# EAGLE design Plipbox (EAGLE 6.6.0)
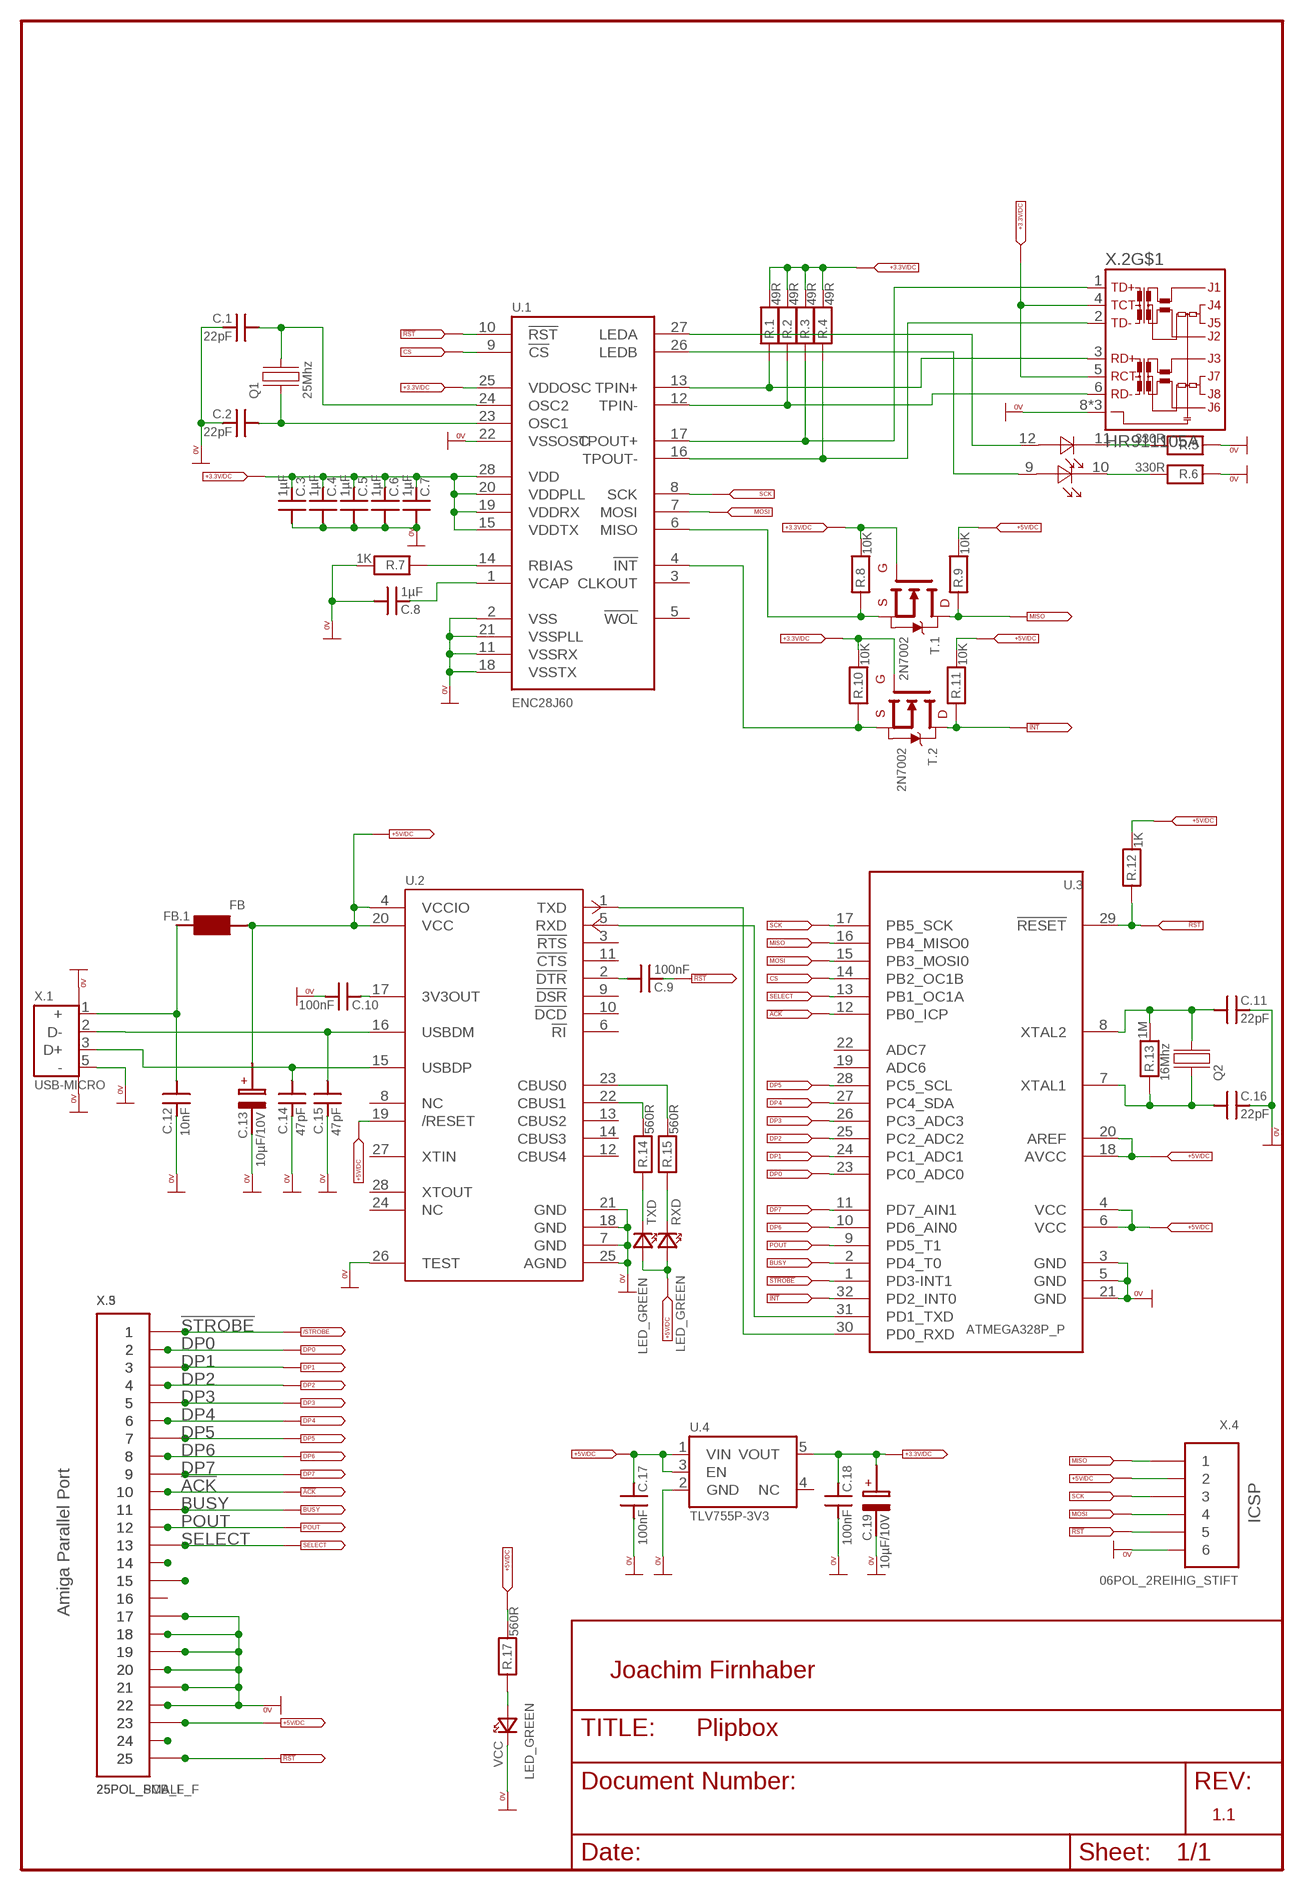
[diagram p0: schematic, sheet 1]

## Parts
C.1  22pF  CAPACITOR_SMD_0805  [0805]
C.2  22pF  CAPACITOR_SMD_0805  [0805]
C.3  1µF  CAPACITOR_SMD_0805  [0805]
C.4  1µF  CAPACITOR_SMD_0805  [0805]
C.5  1µF  CAPACITOR_SMD_0805  [0805]
C.6  1µF  CAPACITOR_SMD_0805  [0805]
C.7  1µF  CAPACITOR_SMD_0805  [0805]
C.8  1µF  CAPACITOR_SMD_0805  [0805]
C.9  100nF  CAPACITOR_SMD_0805  [0805]
C.10  100nF  CAPACITOR_SMD_0805  [0805]
C.11  22pF  CAPACITOR_SMD_0805  [0805]
C.12  10nF  CAPACITOR_SMD_0805  [0805]
C.13  10µF/10V  TANTAL_SMD_A(3216)  [3216]
C.14  47pF  CAPACITOR_SMD_0805  [0805]
C.15  47pF  CAPACITOR_SMD_0805  [0805]
C.16  22pF  CAPACITOR_SMD_0805  [0805]
C.17  100nF  CAPACITOR_SMD_0805  [0805]
C.18  100nF  CAPACITOR_SMD_0805  [0805]
C.19  10µF/10V  TANTAL_SMD_A(3216)  [3216]
FB.1  FB  FERRIT-BEAD  [0805]
Q1  25Mhz  QUARZ_3,4X2,7  [3,4X2,7X0,75]
Q2  16Mhz  QUARZ_3,4X2,7  [3,4X2,7X0,75]
R.1  49R  RESISTOR_SMD_0805  [0805]
R.2  49R  RESISTOR_SMD_0805  [0805]
R.3  49R  RESISTOR_SMD_0805  [0805]
R.4  49R  RESISTOR_SMD_0805  [0805]
R.5  330R  RESISTOR_SMD_0805  [0805]
R.6  330R  RESISTOR_SMD_0805  [0805]
R.7  1K  RESISTOR_SMD_0805  [0805]
R.8  10K  RESISTOR_SMD_0805  [0805]
R.9  10K  RESISTOR_SMD_0805  [0805]
R.10  10K  RESISTOR_SMD_0805  [0805]
R.11  10K  RESISTOR_SMD_0805  [0805]
R.12  1K  RESISTOR_SMD_0805  [0805]
R.13  1M  RESISTOR_SMD_0805  [0805]
R.14  560R  RESISTOR_SMD_0805  [0805]
R.15  560R  RESISTOR_SMD_0805  [0805]
R.17  560R  RESISTOR_SMD_0805  [0805]
RXD  LED_GREEN  LED_0805  [0805]
T.1  2N7002  2N7002_N  [SOT23]
T.2  2N7002  2N7002_N  [SOT23]
TXD  LED_GREEN  LED_0805  [0805]
U.1  ENC28J60  EN28J60  [SSOP28]
U.2  FT232R_FT232RL  [SSOP28]
U.3  ATMEGA328P_P  [LQFP32]
U.4  TLV755P-3V3  TLV755P  [SOT23-5]
VCC  LED_GREEN  LED_0805  [0805]
X.1  USB-MICRO  [USB_MICRO]
X.2  HR911105A  [HR911105A]
X.3  25POL_PCB_F  [SUB-D_25F_L]
X.4  06POL_2REIHIG_STIFT  [STIFT_2*03]
X.5  25POL_SMALL_F  [SUB-D_25F_ONLY]

## Nets
0V: C.1.2 C.2.2 C.3.1 C.4.1 C.5.1 C.6.1 C.7.1 C.8.1 C.10.1 C.11.2 C.12.2 C.13.- C.14.2 C.15.2 C.16.2 C.17.1 C.18.1 C.19.- R.5.1 R.6.1 R.7.2 U.1.2(VSS) U.1.11(VSSRX) U.1.18(VSSTX) U.1.21(VSSPLL) U.1.22(VSSOSC) U.2.7(GND) U.2.18(GND) U.2.21(GND) U.2.25(AGND) U.2.26(TEST) U.3.3(GND) U.3.5(GND) U.3.21(GND) U.4.2(GND) VCC.K(KATHODE) X.1.5(-) X.1.6(GND) X.1.7(GND) X.2.8(GND) X.2.Z1(GND) X.2.Z2(GND) X.3.17 X.3.18 X.3.19 X.3.20 X.3.21 X.3.22 X.4.6 X.5.17 X.5.18 X.5.19 X.5.20 X.5.21 X.5.22
!ACK: U.3.12(PB0_ICP) X.3.10 X.5.10
!INT: R.11.1 T.2.3(DRAIN) U.3.32(PD2_INT0)
!RST: C.9.2 R.12.1 U.1.10(!RST) U.3.29(!RESET) X.3.25 X.4.5 X.5.25
!STROBE: U.3.1(PD3-INT1) X.3.1 X.5.1 ; supply symbol labelled /STROBE
+3.3V: C.3.2 C.4.2 C.5.2 C.6.2 C.7.2 C.18.2 C.19.+ R.1.2 R.2.2 R.3.2 R.4.2 R.8.2 R.10.2 T.1.1(GATE) T.2.1(GATE) U.1.15(VDDTX) U.1.19(VDDRX) U.1.20(VDDPLL) U.1.25(VDDOSC) U.1.28(VDD) U.4.5(VOUT) X.2.4(TCT-) X.2.5(RCT-) ; supply symbol labelled +3.3V-OUT, +3.3V-IN
+5V: C.13.+ C.17.2 FB.1.1 R.9.2 R.11.2 R.12.2 R.17.2 RXD.A(ANODE) TXD.A(ANODE) U.2.4(VCCIO) U.2.19(/RESET) U.2.20(VCC) U.3.4(VCC) U.3.6(VCC) U.3.18(AVCC) U.3.20(AREF) U.4.1(VIN) U.4.3(EN) X.3.23 X.4.2 X.5.23 ; supply symbol labelled +5V-IN, +5V-OUT
/RXLED: R.14.2 U.2.22(CBUS1)
/TXLED: R.15.2 U.2.23(CBUS0)
BUSY: U.3.2(PD4_T0) X.3.11 X.5.11
CS: U.1.9(!CS) U.3.14(PB2_OC1B)
DP0: U.3.23(PC0_ADC0) X.3.2 X.5.2
DP1: U.3.24(PC1_ADC1) X.3.3 X.5.3
DP2: U.3.25(PC2_ADC2) X.3.4 X.5.4
DP3: U.3.26(PC3_ADC3) X.3.5 X.5.5
DP4: U.3.27(PC4_SDA) X.3.6 X.5.6
DP5: U.3.28(PC5_SCL) X.3.7 X.5.7
DP6: U.3.10(PD6_AIN0) X.3.8 X.5.8
DP7: U.3.11(PD7_AIN1) X.3.9 X.5.9
MISO: R.9.1 T.1.3(DRAIN) U.3.16(PB4_MISO0) X.4.1
MOSI: U.1.7(MOSI) U.3.15(PB3_MOSI0) X.4.4
N$1: C.16.1 Q2.2(XTAL1) R.13.1 U.3.7(XTAL1)
N$2: R.4.1 U.1.16(TPOUT-) X.2.2(TD-)
N$3: C.9.1 U.2.2(!DTR)
N$4: R.1.1 U.1.13(TPIN+) X.2.3(RD+)
N$5: C.11.1 Q2.4(XTAL2) R.13.2 U.3.8(XTAL2)
N$6: R.2.1 U.1.12(TPIN-) X.2.6(RD-)
N$7: R.3.1 U.1.17(TPOUT+) X.2.1(TD+)
N$8: C.8.2 U.1.1(VCAP)
N$9: R.7.1 U.1.14(RBIAS)
N$10: R.8.1 T.1.2(SOURCE) U.1.6(MISO)
N$11: X.3.14 X.5.14
N$12: C.2.1 Q1.2(XTAL1) U.1.23(OSC1)
N$13: C.1.1 Q1.4(XTAL2) U.1.24(OSC2)
N$14: R.10.1 T.2.2(SOURCE) U.1.4(!INT)
N$15: X.3.15 X.5.15
N$16: X.3.16 X.5.16
N$18: X.3.24 X.5.24
N$24: U.1.27(LEDA) X.2.12(A)
N$25: U.1.26(LEDB) X.2.9(A)
N$26: R.6.2 X.2.10(K)
N$27: R.5.2 X.2.11(K)
N$28: C.10.2 U.2.17(3V3OUT)
N$29: R.15.1 RXD.K(KATHODE)
N$30: R.14.1 TXD.K(KATHODE)
N$31: U.2.1(TXD) U.3.30(PD0_RXD)
N$32: R.17.1 VCC.A(ANODE)
N$103: C.12.1 FB.1.2 X.1.1(+)
POUT: U.3.9(PD5_T1) X.3.12 X.5.12
SCK: U.1.8(SCK) U.3.17(PB5_SCK) X.4.3
SELECT: U.3.13(PB1_OC1A) X.3.13 X.5.13
TXD1: U.2.5(RXD) U.3.31(PD1_TXD)
USB+: C.14.1 U.2.15(USBDP) X.1.3(D+)
USB-: C.15.1 U.2.16(USBDM) X.1.2(D-)
Unconnected: U.1.3(CLKOUT) U.1.5(!WOL) U.2.3(!RTS) U.2.6(!RI) U.2.8(NC) U.2.9(!DSR) U.2.10(!DCD) U.2.11(!CTS) U.2.12(CBUS4) U.2.13(CBUS2) U.2.14(CBUS3) U.2.24(NC) U.2.27(XTIN) U.2.28(XTOUT) U.3.19(ADC6) U.3.22(ADC7) U.4.4(NC)

## Notes on the sheet
- ICSP
- Amiga Parallel Port
- Joachim Firnhaber
- 1.1

## Library data of the parts
C.1-C.12 C.14-C.18 = de_discrete:CAPACITOR
C.13 C.19 = de_discrete:TANTAL*
FB.1 = de_discrete:FERRIT-BEAD
Q1 Q2 = de_crystal:QUARZ
R.1-R.15 R.17 = de_discrete:RESISTOR
RXD TXD VCC = de_light:LED
T.1 T.2 = de_transistor:2N7002
U.1 = de_ic:EN28J60
U.2 = de_ic:FT232R
U.3 = de_controller:ATMEGA328P
U.4 = de_power:TLV755P
X.1 = de_connectors:USB-MICRO; FCI: 10104110-0001LF
X.2 = de_lan:HR911105A
X.3 X.5 = de_connectors:25POL
X.4 = de_connectors:06POL

## Board
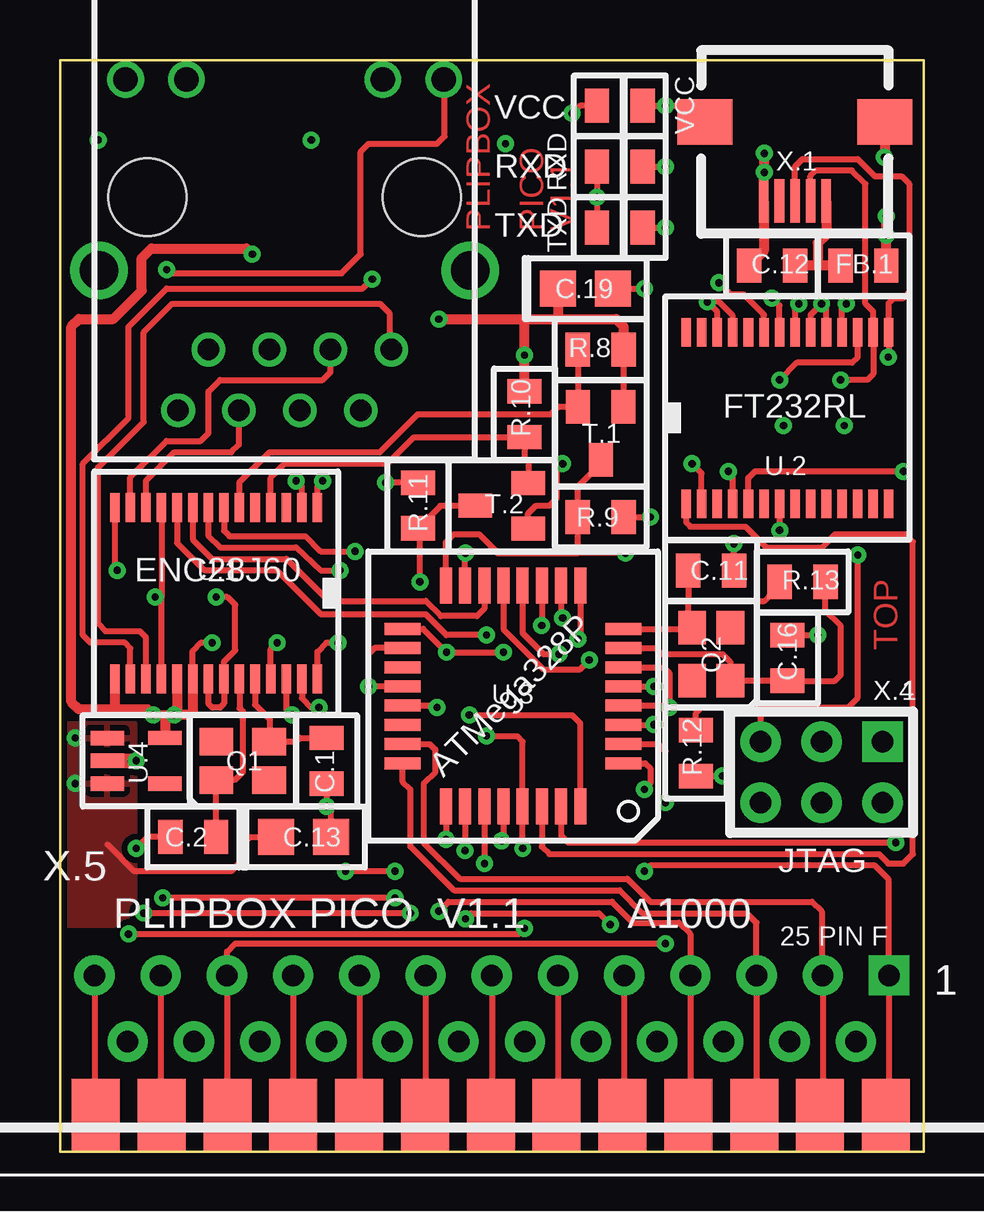
[diagram p1: board, top side]
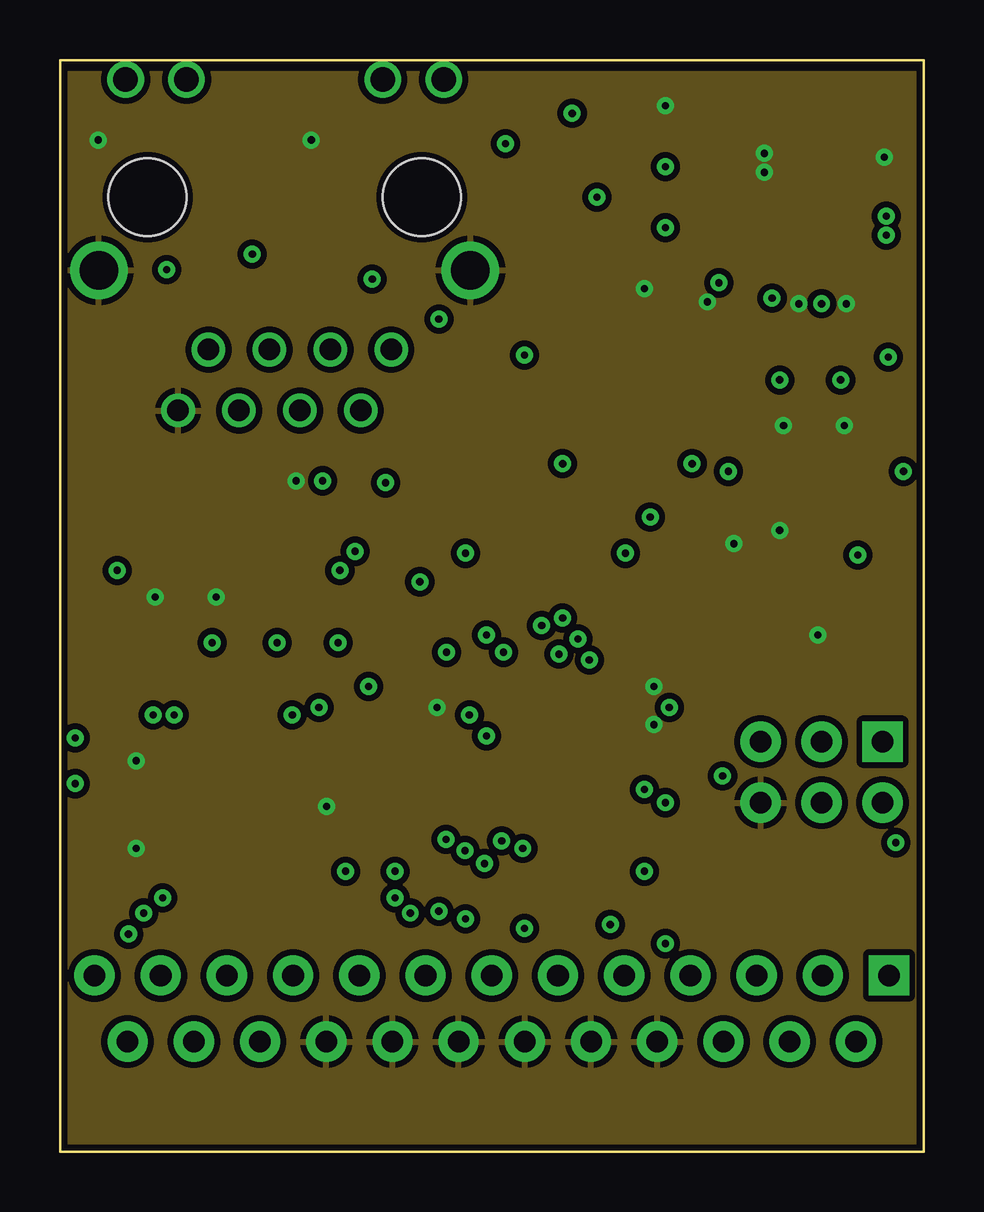
[diagram p2: board, inner layer 0V]
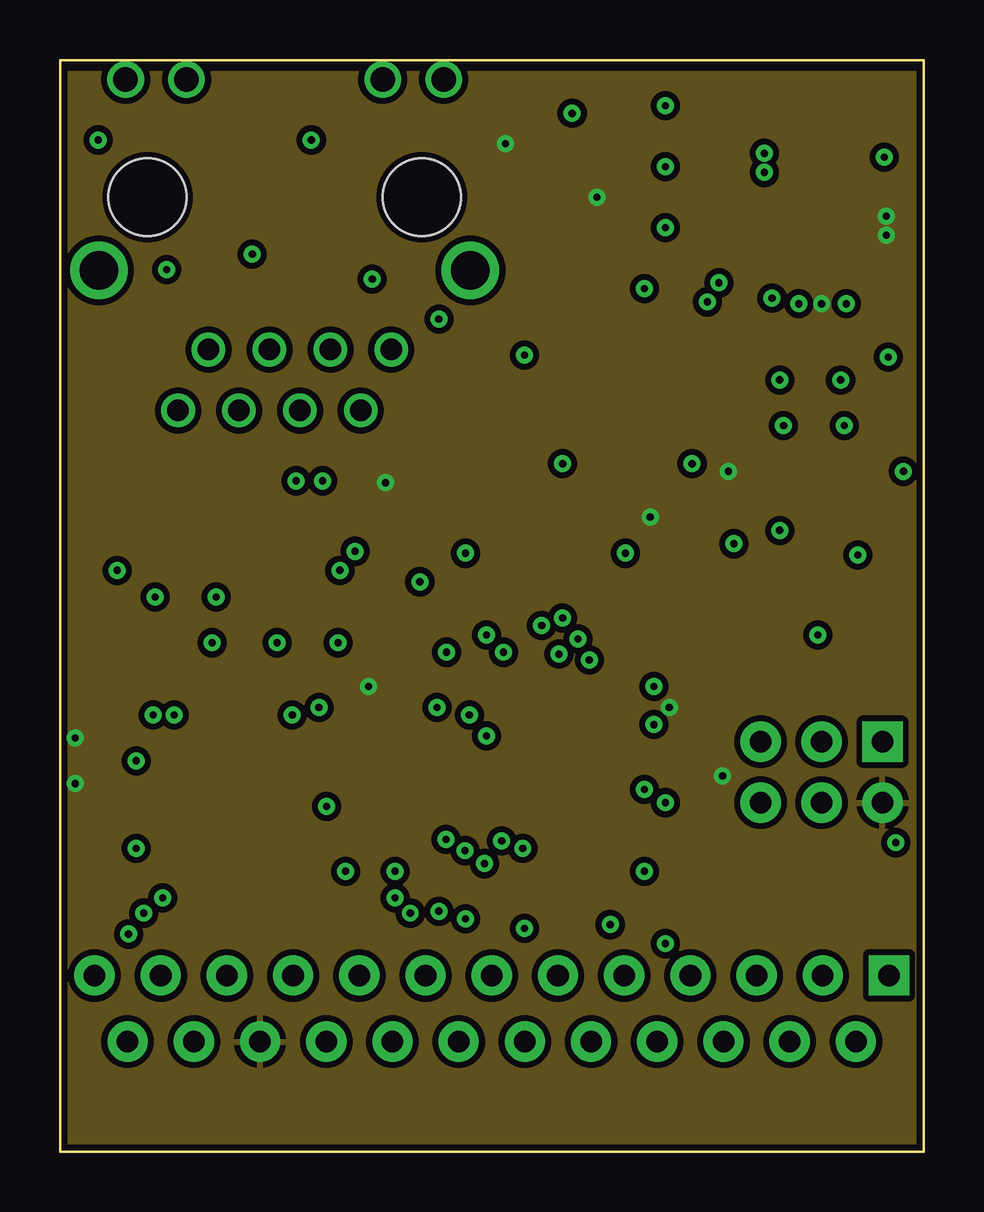
[diagram p3: board, inner layer +5V]
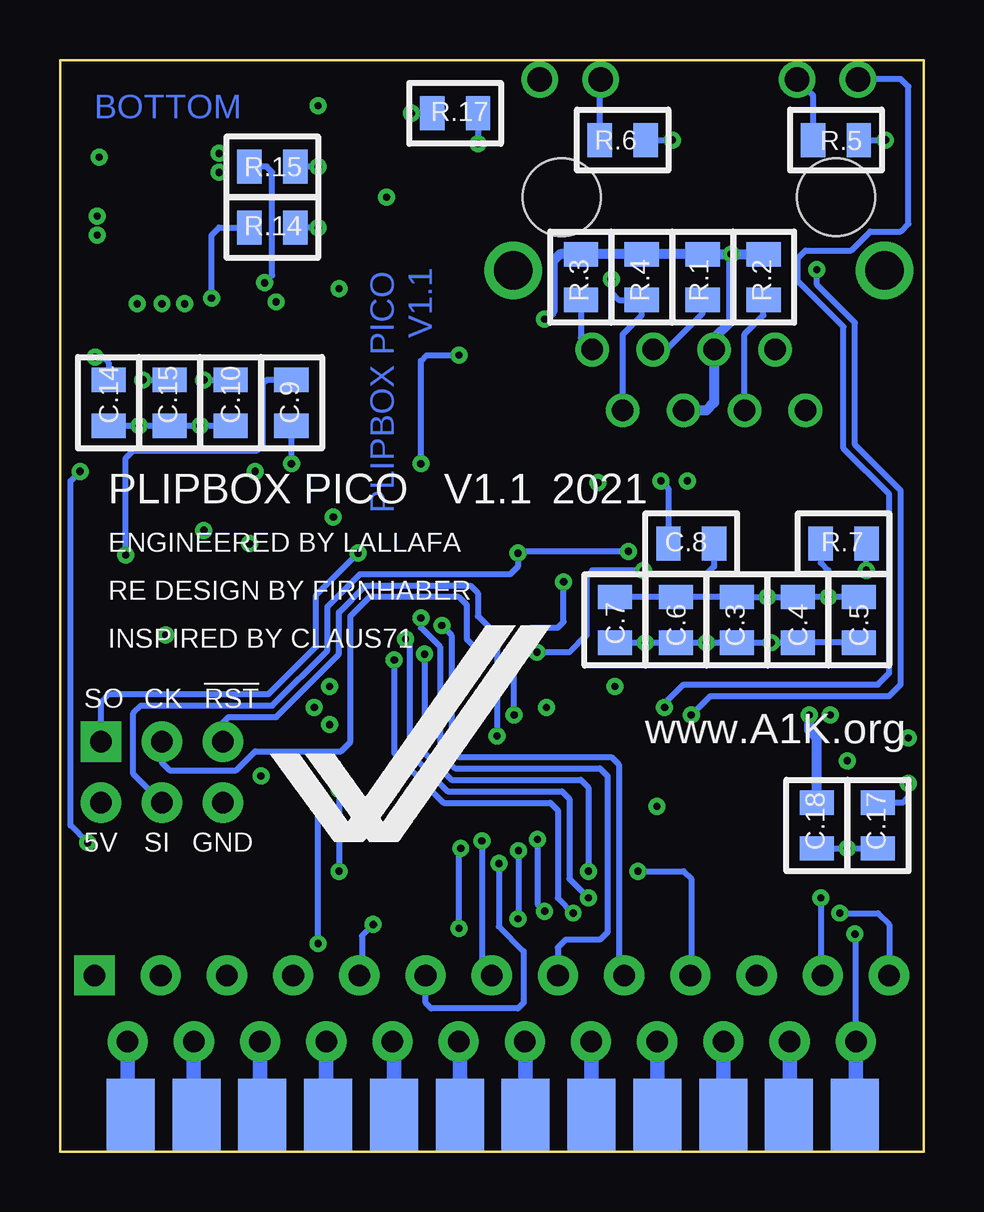
[diagram p4: board, bottom side, seen from below]

Size 36 x 45.5 mm. Coordinates in mm from the lower left corner, seen from the top.
Outline: 0,0 36,0 36,45.5 0,45.5 0,0
Copper layers (1*2*3*16): Top 0.035mm / dielectric 1.5mm / 0V 0.035mm / dielectric 0.15mm / +5V 0.035mm / dielectric 0.2mm / Bottom 0.035mm
Design rules "default *": minimum track width 10mil, minimum drill 10mil, track to track 5mil, track to pad 5mil, pad to pad 5mil, via to via 5mil, smd to smd 1mil, copper to edge 10mil, drill to drill 8mil, minimum pad ring 10mil, minimum via ring 8mil, stop-mask expansion 4mil, vias tented up to drill 20mil, thermal gap 10mil

### Footprints (pad centres in the part's own frame; a part is rotated, then mirrored left to right if it is on the bottom)
0805 = smd 1.016 x 1.422: 1 -0.953,0; 2 0.953,0
3216 = smd 1.5 x 1.5: + -1.15,0; - 1.15,0
3,4X2,7X0,75 = smd 1.4 x 1.15: 1 -1.1,0.8; 2 -1.1,-0.8; 3 1.1,-0.8; 4 1.1,0.8
0805' = smd 1.016 x 1.422: A -0.953,0; K 0.953,0
SOT23 = smd 1 x 1.4: 1 -0.95,-1.1; 2 0.95,-1.1; 3 0,1.1
SSOP28 = smd 0.4 x 1.2: 1 -4.225,-3.575; 2 -3.575,-3.575; 3 -2.925,-3.575; 4 -2.275,-3.575; 5 -1.625,-3.575; 6 -0.975,-3.575; 7 -0.325,-3.575; 8 0.325,-3.575; 9 0.975,-3.575; 10 1.625,-3.575; 11 2.275,-3.575; 12 2.925,-3.575; 13 3.575,-3.575; 14 4.225,-3.575; 15 4.225,3.575; 16 3.575,3.575; 17 2.925,3.575; 18 2.275,3.575; 19 1.625,3.575; 20 0.975,3.575; 21 0.325,3.575; 22 -0.325,3.575; 23 -0.975,3.575; 24 -1.625,3.575; 25 -2.275,3.575; 26 -2.925,3.575; 27 -3.575,3.575; 28 -4.225,3.575
LQFP32 = smd 1.5 x 0.5: 1 -4.6,2.8; 2 -4.6,2; 3 -4.6,1.2; 4 -4.6,0.4; 5 -4.6,-0.4; 6 -4.6,-1.2; 7 -4.6,-2; 8 -4.6,-2.8; 17 4.6,-2.8; 18 4.6,-2; 19 4.6,-1.2; 20 4.6,-0.4; 21 4.6,0.4; 22 4.6,1.2; 23 4.6,2; 24 4.6,2.8 | smd 0.5 x 1.5: 9 -2.8,-4.6; 10 -2,-4.6; 11 -1.2,-4.6; 12 -0.4,-4.6; 13 0.4,-4.6; 14 1.2,-4.6; 15 2,-4.6; 16 2.8,-4.6; 25 2.8,4.6; 26 2,4.6; 27 1.2,4.6; 28 0.4,4.6; 29 -0.4,4.6; 30 -1.2,4.6; 31 -2,4.6; 32 -2.8,4.6
SOT23-5 = smd 0.6 x 1.4: 1 -0.95,-1.2; 2 -0.003,-1.2; 3 0.95,-1.2; 4 0.953,1.2; 5 -0.953,1.2
USB_MICRO = smd 0.4 x 1.8: 1 -1.3,-0.318; 2 -0.65,-0.318; 3 0,-0.318; 4 0.65,-0.318; 5 1.3,-0.318 | smd 2.3 x 1.9: 6 -3.75,-3.615; 7 3.75,-3.615
HR911105A = drill 0.9: 1 4.445,-6.35; 2 3.175,-8.89; 3 1.905,-6.35; 4 0.635,-8.89; 5 -0.635,-6.35; 6 -1.905,-8.89; 7 -3.175,-6.35; 8 -4.445,-8.89 | drill 1.02: 9 6.63,4.91; 10 4.09,4.91; 11 -4.09,4.91; 12 -6.63,4.91 | drill 1.6: Z1 -7.745,-3.05; Z2 7.745,-3.05 | hole 3.25: 5.715,0; -5.715,0
SUB-D_25F_L = smd 2 x 3: 1 16.466,0.5; 2 13.721,0.5; 3 10.976,0.5; 4 8.231,0.5; 5 5.486,0.5; 6 2.741,0.5; 7 -0.004,0.5; 8 -2.749,0.5; 9 -5.494,0.5; 10 -8.237,0.5; 11 -10.98,0.5; 12 -13.723,0.5; 13 -16.466,0.5 | smd 2 x 3 bottom: 14 15.095,0.5; 15 12.35,0.5; 16 9.605,0.5; 17 6.86,0.5; 18 4.115,0.5; 19 1.37,0.5; 20 -1.375,0.5; 21 -4.12,0.5; 22 -6.865,0.5; 23 -9.608,0.5; 24 -12.352,0.5; 25 -15.095,0.5
STIFT_2*03 = drill 0.9 pad 1.676 square: 1 -1.27,2.54 | drill 0.9 pad 1.676: 2 1.27,2.54; 3 -1.27,0; 4 1.27,0; 5 -1.27,-2.54; 6 1.27,-2.54
SUB-D_25F_ONLY = drill 0.9 pad 1.676 square: 1 16.56,13.84 | drill 0.9 pad 1.676: 2 13.8,13.84; 3 11.04,13.84; 4 8.28,13.84; 5 5.52,13.84; 6 2.76,13.84; 7 0,13.84; 8 -2.76,13.84; 9 -5.52,13.84; 10 -8.28,13.84; 11 -11.04,13.84; 12 -13.8,13.84; 13 -16.56,13.84; 14 15.18,11.08; 15 12.42,11.08; 16 9.66,11.08; 17 6.9,11.08; 18 4.14,11.08; 19 1.38,11.08; 20 -1.38,11.08; 21 -4.14,11.08; 22 -6.9,11.08; 23 -9.66,11.08; 24 -12.42,11.08; 25 -15.18,11.08

### Placement (x,y rotation side)
C.1  11.11,16.29 270 top
C.2  5.56,13.11 180 top
C.3  7.78,22.16 270 bottom
C.4  5.24,22.16 270 bottom
C.5  2.7,22.16 270 bottom
C.6  10.32,22.16 270 bottom
C.7  12.86,22.16 270 bottom
C.8  9.68,25.34 180 bottom
C.9  26.35,31.21 90 bottom
C.10  28.89,31.21 90 bottom
C.11  27.15,24.23 0 top
C.12  29.69,36.92 180 top
C.13  10.16,13.11 0 top
C.14  33.97,31.21 270 bottom
C.15  31.43,31.21 270 bottom
C.16  30.32,20.57 90 top
C.17  1.91,13.59 90 bottom
C.18  4.45,13.59 90 bottom
C.19  21.91,35.97 0 top
FB.1  33.5,36.92 180 top
Q1  7.62,16.29 0 top
Q2  27.15,20.73 90 top
R.1  9.21,36.45 90 bottom
R.2  6.67,36.45 90 bottom
R.3  14.29,36.45 90 bottom
R.4  11.75,36.45 90 bottom
R.5  3.65,42.16 180 bottom
R.6  12.54,42.16 180 bottom
R.7  3.33,25.34 180 bottom
R.8  22.54,33.43 0 top
R.9  22.54,26.45 0 top
R.10  19.37,30.73 90 top
R.11  14.92,26.92 90 top
R.12  26.51,16.61 270 top
R.13  30.96,23.75 180 top
R.14  27.15,38.51 180 bottom
R.15  27.15,41.05 180 bottom
R.17  19.53,43.27 0 bottom
RXD  LED_GREEN  [0805']  23.34,41.05 0 top
T.1  22.54,29.94 180 top
T.2  18.41,26.92 90 top
TXD  LED_GREEN  [0805']  23.34,38.51 0 top
U.1  6.51,23.27 180 top
U.2  30.32,30.57 0 top
U.3  18.89,18.99 180 top
U.4  3.17,16.29 270 top
VCC  LED_GREEN  [0805']  23.34,43.59 0 top
X.1  30.64,39.31 180 top
X.2  9.37,39.78 0 top
X.3  17.96,1.04 0 top
X.4  31.75,15.81 270 top
X.5  18,-6.5 0 top

### Tracks (layer width: path | path; a pad name or v marks a point on that pad's centre or on a via)
0V  (via drill 0.3)
  Top 0.254: C.13.- 11.31,14.19 v11.11,14.38 C.1.2 | C.2.2 3.65,13.11 v3.17,12.64 | v3.17,16.29 | U.1.18 4.23,23.06 | 4.23,23.06 4.23,23.09 | 4.23,23.09 v3.97,23.11 4.23,23.06 | v6.51,23.11 6.99,23.11 7.3,22.8 7.3,20.89 6.83,20.42 U.1.22 6.83,18.68 6.67,18.51 6.35,18.51 6.18,18.68 U.1.21 | U.1.11 4.23,23.09 | U.3.21 15.64,18.59 v15.72,18.51 | C.11.2 v28.1,25.34 | U.2.7 30,26.04 v30,25.89 | C.16.2 v31.59,21.53 | U.1.2 10.08,27.72 v9.84,27.96 | VCC.K v25.24,43.59 26.85,43.59 X.1.7 | U.2.18 32.6,35.15 v32.78,35.34 | U.2.21 30.65,35.19 v30.8,35.34 | C.19.- v24.37,35.97 | U.3.3 24.84,17.79 v24.77,17.8 | U.3.5 24.84,19.39 v24.77,19.38 | U.2.25 28.05,34.83 27.46,35.42 v26.99,35.42 27.4,35.01 U.2.26
  Top 0.406: C.12.2 29.34,37.53 X.1.5 29.34,40.78 v29.37,40.81 v29.37,41.61 | X.1.6 34.39,41.47 v34.37,41.45
  Top 0.61: U.4.2 v3.17,16.29
  Bottom 0.254: C.17.1 v3.17,12.64 C.18.1 | v3.97,23.11 C.4.1 v6.51,23.11 C.3.1 9.05,23.11 | C.5.1 v3.97,23.11 | R.7.2 4.29,24.54 3.97,24.23 v3.97,23.11 | 9.05,23.11 C.6.1 C.7.1 | C.8.1 8.73,24.38 9.05,24.07 9.05,23.11 | R.6.1 v10.48,42.16 | C.14.2 v32.7,30.26 C.15.2 v30.16,30.26 C.10.1 | R.5.1 v1.59,42.16 | 24.9,1.61 X.3.17
  Bottom 0.61: X.5.17 24.9,1.61 | X.3.22 X.5.22 | X.3.21 13.84,4.56 X.5.21 | X.3.20 16.59,4.55 X.5.20 | X.3.19 19.33,4.53 X.5.19 | X.3.18 22.08,4.52 X.5.18
  pour 0V (isolate 0.254): 0,0 0,45 36,45 36,0
!ACK  (via drill 0.3)
  Top 0.254: U.3.12 19.29,22.4 19.29,21.61 20.16,20.73 v20.8,20.73 | X.5.10 X.3.10 | v13.97,11.68 v11.91,11.68
  Bottom 0.254: v20.8,20.73 20.8,16.61 19.68,15.49 14.29,15.49 13.97,15.18 v13.97,11.68 | v11.91,11.68 10,11.68 9.68,11.37 9.68,7.38 X.5.10
!INT  (via drill 0.3)
  Top 0.254: T.2.3 15.86,26.91 R.11.1 15,25.89 v15,23.75 | v17.07,18.19 21.35,18.19 21.69,17.85 U.3.32
  Bottom 0.254: v17.07,18.19 17.07,21.13 16.35,21.84 15.24,21.84 15,22.08 v15,23.75
!RST  (via drill 0.3)
  Top 0.254: U.1.10 4.88,25.37 6.03,24.23 9.05,24.23 10.87,22.4 15.24,22.4 16.11,21.53 v17.78,21.53 | 29.21,18.51 32.86,18.51 33.26,18.91 v33.26,24.86 | R.12.1 26.51,18.27 26.75,18.51 29.21,18.51 | X.4.5 29.21,18.51 | v2.86,9.06 19.13,9.06 v19.37,9.3 | v19.29,12.64 U.3.29 19.29,17.08 19.05,17.32 v17.78,17.32
  Bottom 0.254: C.9.2 27.38,32.16 27.54,32 27.54,29.46 27.78,29.23 32.94,29.23 33.26,28.91 v33.26,24.86 | X.4.5 29.21,17.88 28.97,18.11 26.99,18.11 24.37,20.73 24.37,22.48 23.26,23.59 18.89,23.59 18.57,23.27 18.57,22.32 v17.78,21.53 v17.78,17.32 | 2.82,1.58 X.3.25 | X.5.25 2.82,8.95 v2.86,9.06 | v19.37,9.3 19.37,12.56 v19.29,12.64
  Bottom 0.61: X.5.25 2.82,1.58
!STROBE  (via drill 0.3)
  Top 0.254: U.3.1 24.39,16.19 24.61,15.97 24.61,15.34 v24.37,15.1 | X.3.1 34.56,1.67 X.5.1 34.53,7.37 34.53,11.37 33.97,11.92 24.61,11.92 v24.37,11.68
  Bottom 0.254: v24.37,15.1 v24.37,11.68
+3.3V  (via drill 0.3)
  Top 0.254: 4.88,18.31 v4.76,18.19 | U.1.20 5.53,20.87 5.87,21.21 v6.35,21.21 | U.1.25 8.78,20.94 v9.05,21.21 | U.1.28 10.73,20.83 11.11,21.21 v11.59,21.21 | R.8.2 T.1.1 | 2.27,18.43 2.28,18.45 | T.2.1 19.52,26.59 19.84,26.92 20.4,26.92 20.72,27.24 20.72,28.43 v20.95,28.67
  Top 0.406: U.1.19 4.88,18.31 | U.1.20 5.53,18.33 5.4,18.19 v4.76,18.19 v3.89,18.19 | U.1.15 2.28,18.45 | v15.8,34.7 19.37,34.7 | 19.37,34.7 20.8,34.7 | v3.89,18.19 4.38,18.19 U.4.5 | v3.89,18.19 3.65,18.43 2.27,18.43 0.79,18.43 0.48,18.75 0.48,34.38 0.79,34.7 2.22,34.7 3.41,35.89 3.41,37.24 3.81,37.64 7.78,37.64 v8.02,37.4 | C.19.+ 20.76,34.74 20.8,34.7 | 20.8,34.7 23.18,34.7 23.5,34.38 R.8.2 | R.10.2 v19.37,33.19 19.37,34.7
  Bottom 0.254: C.7.2 v11.59,21.21 C.6.2 v9.05,21.21 C.3.2 v6.35,21.21 C.4.2 C.5.2 | v20.95,28.67 20.95,32.96 20.72,33.19 v19.37,33.19
  Bottom 0.406: C.18.2 4.45,17.24 4.76,17.56 v4.76,18.19 | v8.02,37.4 R.1.2 R.4.2 R.3.2 15.16,37.4 15.48,37.08 15.48,35.02 v15.8,34.7 | v8.02,37.4 R.2.2 | X.2.4 9.05,30.89 8.73,31.21 X.2.5 8.73,33.91 8.02,34.62 v8.02,37.4
+5V  (via drill 0.3)
  Top 0.254: C.13.+ 7.94,13.11 7.62,12.79 7.62,12.16 7.14,11.68 3.1,11.68 1.98,12.79 | U.3.18 13.11,20.99 12.86,20.73 v12.86,19.38 v12.86,19.39 U.3.20 | RXD.A v22.38,39.78 TXD.A | U.2.19 31.95,35.14 v31.75,35.34 31.3,34.88 U.2.20 | R.11.2 v13.57,27.88 | R.9.2 v24.61,26.45 | U.2.4 28.05,28.17 v27.86,28.35 | U.3.6 25.15,20.19 25.4,19.94 25.4,18.59 | U.3.4 25.4,18.59 | v25.4,18.51 25.4,18.59 | R.12.2 v27.62,15.65
  Top 0.406: v34.45,38.99 FB.1.1 v34.45,38.2
  Bottom 0.254: v0.64,15.34 0.64,14.78 0.87,14.54 C.17.2 | R.17.2 v18.57,42.01 | 8.34,1.55 X.3.23
  Bottom 0.61: X.5.23 8.34,1.55
  other vias: 0.64,17.24
  pour +5V (isolate 0.254): 0,0 0,45 36,45 36,0
  pour Top (isolate 0.254): 0.24,9.38 3.17,9.38 3.17,17.88 0.24,17.88
/RXLED  (via drill 0.3)
  Top 0.254: U.2.22 30,35.27 v29.69,35.58
  Bottom 0.254: v29.69,35.58 29.69,38.2 29.37,38.51 R.14.2
/TXLED  (via drill 0.3)
  Top 0.254: U.2.23 29.35,34.88 28.5,35.73 27.94,35.73 v27.46,36.21
  Bottom 0.254: v27.46,36.21 27.15,36.53 27.15,40.81 27.38,41.05 R.15.2
BUSY  (via drill 0.3)
  Top 0.254: U.3.2 24.94,16.99 25.24,16.68 v25.24,14.54 | X.3.11 6.96,1.56 X.5.11 6.96,8.32 7.3,8.67 v25.24,8.67
  Bottom 0.254: v25.24,8.67 v25.24,14.54
CS
  Top 0.254: U.1.9 5.53,25.52 6.35,24.7 9.45,24.7 11.19,22.95 15.24,22.95 15.88,22.32 17.38,22.32 17.69,22.63 U.3.14
DP0
  Top 0.254: X.3.2 31.8,1.65 X.5.2 31.75,7.39 31.75,10.02 31.35,10.41 24.61,10.41 23.65,11.37 16.67,11.37 15.16,12.87 15.16,15.34 15.64,15.81 15.64,16.76 15.41,16.99 U.3.23
DP1
  Top 0.254: X.3.3 29.04,1.64 X.5.3 29.04,9.54 28.64,9.94 24.29,9.94 23.34,10.89 16.43,10.89 14.61,12.72 14.61,15.1 14.29,15.41 U.3.24
DP2  (via drill 0.3)
  Top 0.254: U.3.25 v16.09,13.01 | X.3.4 26.28,1.62 X.5.4 26.27,9.06 25.8,9.54 23.89,9.54 23.02,10.41 16.19,10.41 v15.8,10.02
  Bottom 0.254: v16.09,13.01 16.09,10.31 v15.8,10.02
DP3  (via drill 0.3)
  Top 0.254: U.3.26 v16.89,12.54 | X.5.5 23.52,1.61 X.3.5 | v16.91,9.7 17.14,9.94 22.46,9.94 v22.94,9.46
  Bottom 0.254: v16.89,12.54 16.89,9.95 v16.91,9.7 | v22.94,9.46 23.42,8.98 23.42,7.44 X.5.5
DP4  (via drill 0.3)
  Top 0.254: U.3.27 17.69,12.09 v17.7,12 | X.5.6 20.76,1.59 X.3.6
  Bottom 0.254: v17.7,12 17.7,9.38 16.67,8.35 16.67,6.21 16.91,5.97 20.52,5.97 20.76,6.21 X.5.6
DP5  (via drill 0.3)
  Top 0.254: 18.49,7.83 X.5.7 18,1.58 X.3.7 | U.3.28 18.49,13.03 v18.41,12.95
  Bottom 0.254: v18.41,12.95 18.41,7.75 X.5.7
DP6  (via drill 0.3 pad 0.15)
  Top 0.254: U.3.10 20.89,22.3 v20.95,22.24 | X.5.8 15.24,1.56 X.3.8
  Bottom 0.254: v20.95,22.24 20.95,21.84 20.16,21.05 20.16,16.61 19.53,15.97 13.49,15.97 13.18,15.65 13.18,9.14 13.49,8.83 14.92,8.83 15.24,8.51 X.5.8
DP7  (via drill 0.3 pad 0.15)
  Top 0.254: U.3.11 20.09,21.93 v20.08,21.92 | X.5.9 X.3.9
  Bottom 0.254: v20.08,21.92 19.68,21.53 19.68,16.76 19.37,16.45 13.02,16.45 12.7,16.13 12.7,7.56 X.5.9
MISO  (via drill 0.3)
  Top 0.254: T.1.3 22.54,28.67 21.59,27.72 R.9.1 21.59,24.94 | U.3.16 16.09,25.39 16.43,25.73 17.46,25.73 18.26,24.94 21.59,24.94 | v23.57,24.94 21.59,24.94
  Bottom 0.254: X.4.1 34.29,18.75 33.97,19.07 27.3,19.07 25.32,21.05 25.32,23.19 v23.57,24.94
MOSI  (via drill 0.3)
  Top 0.254: U.1.7 6.83,25.88 7.06,25.65 10.24,25.65 10.87,25.02 v12.3,25.02 | U.3.15 16.89,24.92 v16.91,24.94
  Bottom 0.254: X.4.4 32.94,15.73 32.94,18.27 32.62,18.59 27.15,18.59 24.84,20.89 24.84,22.72 23.5,24.07 17.22,24.07 16.91,24.38 v16.91,24.94 16.83,25.02 v12.3,25.02
N$1
  Top 0.254: R.13.1 31.91,22.56 32.54,21.92 32.54,19.86 32.31,19.62 C.16.1 Q2.2 27.94,20.41 27.62,20.73 25.08,20.73 24.83,20.99 U.3.7
N$2  (via drill 0.3)
  Top 0.254: U.1.16 2.93,20.97 2.7,21.21 1.27,21.21 0.95,21.53 0.95,28.67 2.86,30.57 2.86,34.38 4.45,35.97 12.62,35.97 v13.02,36.37
  Bottom 0.254: X.2.2 12.54,34.07 11.75,34.86 R.4.1 12.7,35.5 13.02,35.81 v13.02,36.37
N$3  (via drill 0.3)
  Top 0.254: U.2.2 26.75,28.28 v26.35,28.67
  Bottom 0.254: v26.35,28.67 C.9.1
N$4
  Top 0.254: U.1.13 2.93,28.11 4.45,29.62 5.87,29.62 6.19,29.94 6.19,31.69 6.67,32.16 10.95,32.16 11.27,32.48 X.2.3
  Bottom 0.254: X.2.3 10.72,33.43 9.21,34.94 R.1.1
N$5
  Top 0.254: 26.19,22.95 26.19,22.32 26.35,22.17 Q2.4 26.3,21.79 U.3.8 | C.11.1 26.19,22.95 | 26.19,22.95 29.37,22.95 29.69,23.27 29.69,23.43 R.13.2
N$6
  Top 0.254: U.1.12 3.58,27.97 4.76,29.15 7.14,29.15 7.46,29.46 X.2.6
  Bottom 0.254: X.2.6 7.46,34.07 6.67,34.86 R.2.1
N$7
  Top 0.254: U.1.17 3.58,21.43 3.33,21.68 1.91,21.68 1.59,22 1.59,28.51 3.49,30.42 3.49,34.15 4.68,35.34 13.34,35.34 13.73,34.94 13.73,33.51 X.2.1
  Bottom 0.254: R.3.1 14.29,33.91 X.2.1
N$8  (via drill 0.3)
  Top 0.254: U.1.1 10.73,27.74 v10.95,27.96
  Bottom 0.254: v10.95,27.96 10.64,27.64 C.8.2
N$9  (via drill 0.3)
  Top 0.254: U.1.14 2.28,24.32 v2.38,24.23
  Bottom 0.254: v2.38,24.23 R.7.1
N$10
  Top 0.254: U.1.6 7.48,27.9 8.73,29.15 13.34,29.15 14.92,30.73 20.48,30.73 20.8,31.05 T.1.2 R.8.1
N$11
  Bottom 0.254: 33.18,1.66 X.3.14
  Bottom 0.61: X.5.14 33.18,1.66
N$12
  Top 0.254: C.2.1 6.51,15.48 Q1.2 7.3,15.49 7.62,15.81 7.62,18.35 7.48,18.49 U.1.23
N$13
  Top 0.254: U.1.24 8.13,18.63 8.73,18.03 Q1.4 9.85,17.09 10,17.24 C.1.1
N$14
  Top 0.254: U.1.4 8.78,28.09 9.37,28.67 13.65,28.67 14.76,29.78 R.10.1 19.37,28.91 19.53,28.75 19.53,27.89 T.2.2
N$15
  Bottom 0.254: 30.42,1.65 X.3.15
  Bottom 0.61: X.5.15 30.42,1.65
N$16
  Bottom 0.254: 27.66,1.63 X.3.16
  Bottom 0.61: X.5.16 27.66,1.63
N$18
  Bottom 0.254: 5.58,1.57 X.3.24
  Bottom 0.61: X.5.24 5.58,1.57
N$24  (via drill 0.3)
  Top 0.254: U.1.27 10.08,18.9 10.48,18.51 v10.79,18.51
  Bottom 0.254: v10.79,18.51 10.79,18.67 10,19.46 1.91,19.46 1.43,19.94 1.43,27.4 3.33,29.3 3.33,34.38 5.24,36.29 5.24,37.24 4.92,37.56 3.02,37.56 2.22,38.35 0.95,38.35 0.64,38.67 0.64,44.39 0.95,44.7 2.73,44.7 X.2.12
N$25  (via drill 0.3)
  Top 0.254: U.1.26 9.43,18.44 v9.68,18.19 | v4.45,36.77 4.6,36.61 11.75,36.61 12.54,37.4 12.54,41.69 12.86,42.01 15.72,42.01 16.03,42.32 16.03,44.66 X.2.9
  Bottom 0.254: v9.68,18.19 8.89,18.99 1.43,18.99 0.95,19.46 0.95,27.56 2.86,29.46 2.86,34.54 4.45,36.13 v4.45,36.77
N$26
  Bottom 0.254: R.6.2 13.49,44.66 X.2.10
N$27
  Bottom 0.254: R.5.2 4.6,44.02 X.2.11
N$28  (via drill 0.3)
  Top 0.254: U.2.17 33.25,33.1 33.02,32.88 30.72,32.88 v30,32.16
  Bottom 0.254: v30,32.16 C.10.2
N$29  (via drill 0.3)
  Top 0.254: RXD.K v25.24,41.05
  Bottom 0.254: v25.24,41.05 R.15.1
N$30  (via drill 0.3)
  Top 0.254: TXD.K v25.24,38.51
  Bottom 0.254: v25.24,38.51 R.14.1
N$31
  Top 0.254: U.2.1 26.1,26.23 26.27,26.05 28.57,26.05 29.45,25.18 31.75,25.18 32.31,25.73 35.24,25.73 35.56,25.42 35.56,12.4 35.16,12 34.53,12 34.13,12.4 20.4,12.4 20.09,12.71 U.3.30
N$32  (via drill 0.3)
  Top 0.254: VCC.A 21.67,43.59 v21.35,43.27
  Bottom 0.254: v21.35,43.27 R.17.1
N$103
  Top 0.406: X.1.1 31.94,38.23 31.59,37.88 31.59,36.92 | 31.59,36.92 C.12.1 | FB.1.2 31.59,36.92
POUT  (via drill 0.3, 0.3 pad 0.15)
  Top 0.254: U.3.9 21.69,21.47 v21.59,21.37 | X.5.12 4.2,1.58 X.3.12 | v13.97,10.57 v4.29,10.57
  Bottom 0.254: v21.59,21.37 21.43,21.21 21.43,16.61 19.84,15.02 15.08,15.02 14.76,14.7 14.76,11.37 v13.97,10.57 | v4.29,10.57 4.29,7.43 X.5.12
SCK  (via drill 0.3)
  Top 0.254: U.1.8 6.18,25.66 6.67,25.18 9.84,25.18 10.87,24.23 v11.67,24.23 | U.3.17 15.14,21.79 v16.11,20.81 v18.49,20.81
  Bottom 0.254: X.4.3 31.75,16.21 31.43,15.89 28.65,15.89 27.86,16.68 24.29,16.68 23.89,17.08 23.89,22.32 23.1,23.11 19.37,23.11 19.05,22.8 19.05,21.37 v18.49,20.81 | v16.11,20.81 14.76,20.81 14.05,21.53 14.05,23.99 13.81,24.23 v11.67,24.23
SELECT  (via drill 0.3)
  Top 0.254: U.3.13 18.49,21.77 20.16,20.1 21.67,20.1 v22.07,20.49 | X.5.13 1.44,1.59 X.3.13 | v14.61,9.94 v3.49,9.94
  Bottom 0.254: v22.07,20.49 22.07,16.61 20,14.54 15.56,14.54 15.24,14.22 15.24,10.57 v14.61,9.94 | v3.49,9.94 1.91,9.94 1.43,9.46 X.5.13
TXD1  (via drill 0.3)
  Top 0.254: U.3.31 20.89,13.18 21.19,12.87 v34.85,12.87 | v35.16,28.35 28.97,28.35 28.7,28.08 U.2.5
  Bottom 0.254: v34.85,12.87 35.56,13.59 35.56,27.96 v35.16,28.35
USB+  (via drill 0.3)
  Top 0.254: v34.53,33.11 34.55,33.13 U.2.15 34.55,35.36 34.77,35.58 35.16,35.58 35.4,35.81 35.4,40.34 35.08,40.66 33.97,40.66 33.26,41.37 30.96,41.37 30.64,41.05 X.1.3
  Bottom 0.254: v34.53,33.11 34.21,33.11 33.97,32.88 C.14.1
USB-  (via drill 0.3)
  Top 0.254: v32.54,32.16 33.66,32.16 33.9,32.4 U.2.16 33.9,35.02 33.58,35.34 33.58,40.34 33.02,40.89 31.51,40.89 31.29,40.67 X.1.2
  Bottom 0.254: v32.54,32.16 C.15.1

### Text on the board
Top: PLIPBOX | PICO | V1.1 | TOP
Bottom: BOTTOM | V1.1 | PLIPBOX PICO
tPlace: VCC | RXD | TXD | FT232RL | ENC28J60 | 1 | ATMega328P | JTAG | PLIPBOX PICO | V1.1 | A1000 | 25 PIN F
bPlace: 2021 | V1.1 | PLIPBOX PICO | ENGINEERED BY LALLAFA | RE DESIGN BY FIRNHABER | INSPIRED BY CLAUS71 | !RST | CK | SO | www.A1K.org | GND | SI | 5V